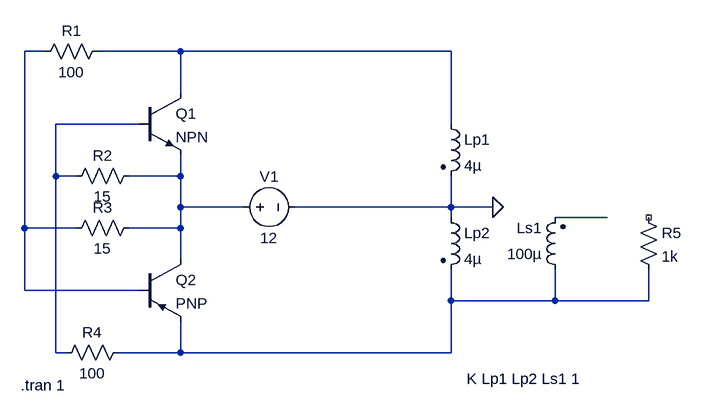
[diagram p0: schematic vib6_bjt_cross_coupled_inverter.asc]
vib6_bjt_cross_coupled_inverter.asc, the LTspice schematic file:
Version 4
SHEET 1 952 680
WIRE -32 16 -64 16
WIRE 176 16 48 16
WIRE 592 16 176 16
WIRE 176 80 176 16
WIRE 112 128 -16 128
WIRE 592 128 592 16
WIRE -16 208 -16 128
WIRE 16 208 -16 208
WIRE 176 208 176 176
WIRE 176 208 96 208
WIRE 176 256 176 208
WIRE 272 256 176 256
WIRE 592 256 592 208
WIRE 592 256 352 256
WIRE 656 256 592 256
WIRE 592 272 592 256
WIRE 832 272 752 272
WIRE -64 288 -64 16
WIRE 16 288 -64 288
WIRE 176 288 176 256
WIRE 176 288 96 288
WIRE 176 336 176 288
WIRE -64 384 -64 288
WIRE 112 384 -64 384
WIRE 592 400 592 352
WIRE 752 400 752 352
WIRE 752 400 592 400
WIRE 896 400 896 352
WIRE 896 400 752 400
WIRE -16 480 -16 208
WIRE 0 480 -16 480
WIRE 176 480 176 432
WIRE 176 480 80 480
WIRE 592 480 592 400
WIRE 592 480 176 480
FLAG 656 256 0
SYMBOL npn 112 80 R0
SYMATTR InstName Q1
SYMBOL pnp 112 336 R0
SYMATTR InstName Q2
SYMBOL res 64 0 R90
WINDOW 0 0 56 VBottom 2
WINDOW 3 32 56 VTop 2
SYMATTR InstName R1
SYMATTR Value 100
SYMBOL res 112 192 R90
WINDOW 0 0 56 VBottom 2
WINDOW 3 32 56 VTop 2
SYMATTR InstName R2
SYMATTR Value 15
SYMBOL res 112 272 R90
WINDOW 0 0 56 VBottom 2
WINDOW 3 32 56 VTop 2
SYMATTR InstName R3
SYMATTR Value 15
SYMBOL res 96 464 R90
WINDOW 0 0 56 VBottom 2
WINDOW 3 32 56 VTop 2
SYMATTR InstName R4
SYMATTR Value 100
SYMBOL voltage 256 256 R270
WINDOW 0 32 56 VTop 2
WINDOW 3 -32 56 VBottom 2
WINDOW 123 0 0 Left 0
WINDOW 39 0 0 Left 0
SYMATTR InstName V1
SYMATTR Value 12
SYMBOL ind2 576 256 R0
SYMATTR InstName Lp2
SYMATTR Value 4µ
SYMATTR Type ind
SYMBOL ind2 768 368 R180
WINDOW 0 36 80 Left 2
WINDOW 3 36 40 Left 2
SYMATTR InstName Ls1
SYMATTR Value 100µ
SYMATTR Type ind
SYMBOL res 880 256 R0
SYMATTR InstName R5
SYMATTR Value 1k
SYMBOL ind2 576 112 R0
SYMATTR InstName Lp1
SYMATTR Value 4µ
SYMATTR Type ind
TEXT -70 530 Left 2 !.tran 1
TEXT 616 520 Left 2 !K Lp1 Lp2 Ls1 1

The netlist it stands for:
* vib6_bjt_cross_coupled_inverter.asc
Q1 N002 N003 N004 0 NPN
Q2 N004 N001 N006 0 PNP
R1 N002 N001 100
R2 N004 N003 15
R3 N004 N001 15
R4 N006 N003 100
V1 N004 0 12
Lp2 0 N006 4µ
Ls1 N006 N005 100µ
R5 NC_01 N006 1k
Lp1 N002 0 4µ
.model NPN NPN
.model PNP PNP
.lib standard.bjt
.tran 1
K Lp1 Lp2 Ls1 1
.backanno
.end